# Altium schematic sheet Low Side Drivers.SchDoc: Ravage - Low Side Drivers
size A4; Address1: Drawn By:; Address2: Dan Visser; DocumentNumber: A; Revision: 0.1-alpha; SheetNumber: 12; SheetTotal: 16
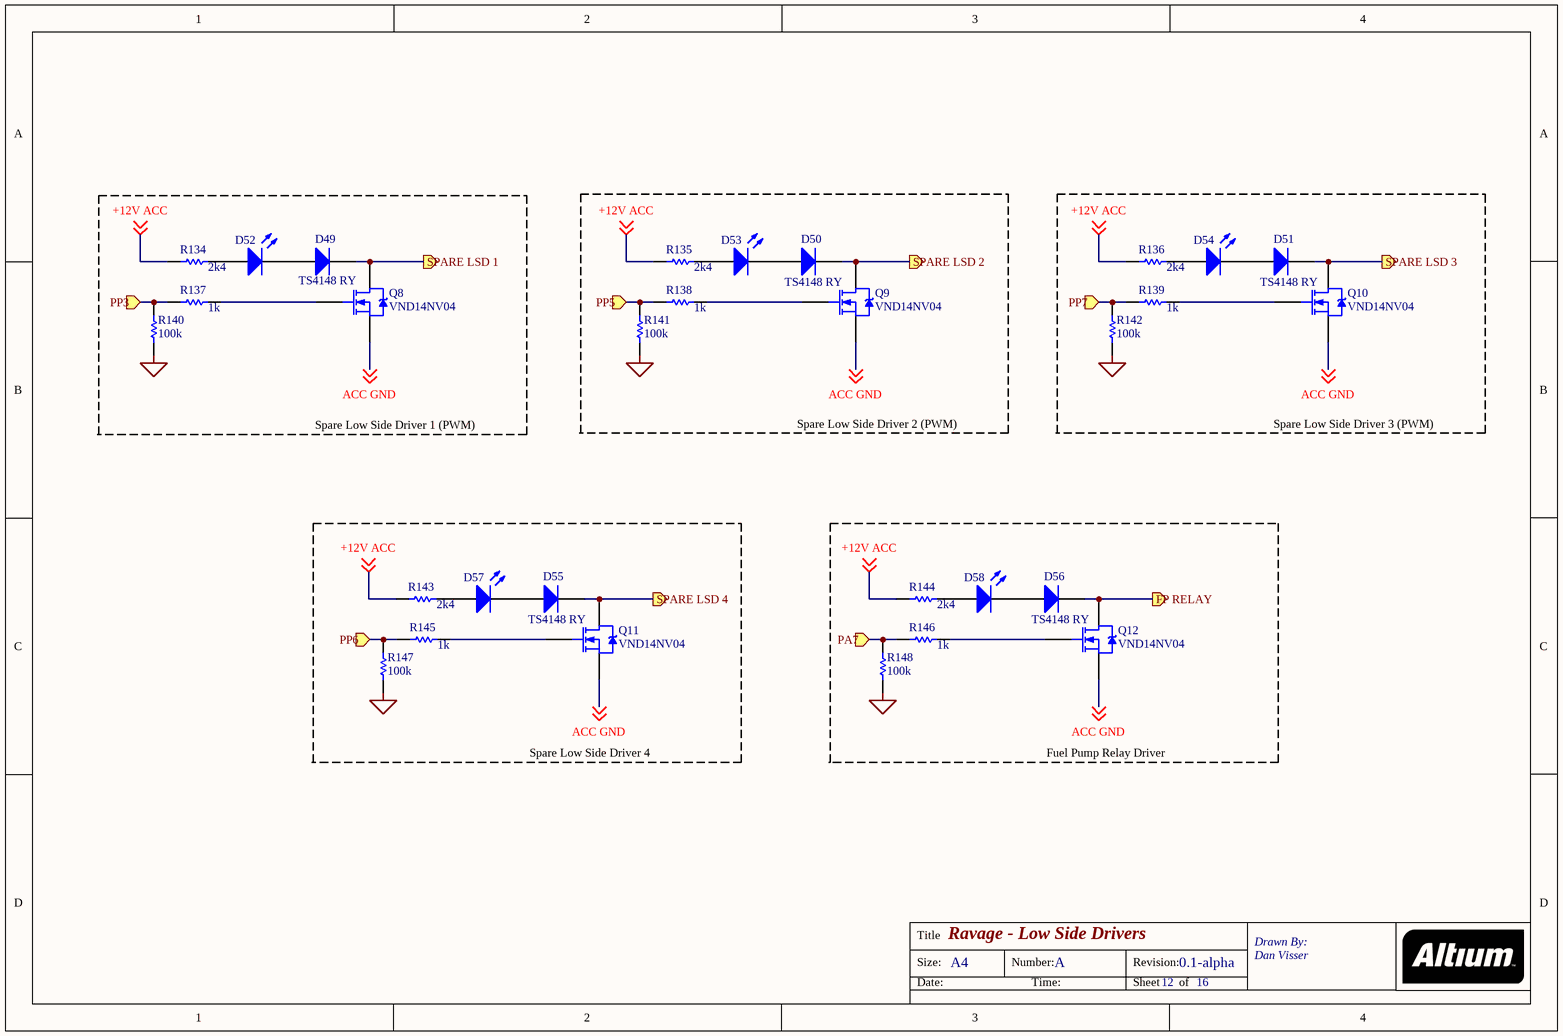
[diagram p0: Low Side Drivers.SchDoc]

## Parts
D49  TS4148 RY  [SMC]
D50  TS4148 RY  [SMC]
D51  TS4148 RY  [SMC]
D52  (no value)  [LED-0]
D53  (no value)  [LED-0]
D54  (no value)  [LED-0]
D55  TS4148 RY  [SMC]
D56  TS4148 RY  [SMC]
D57  (no value)  [LED-0]
D58  (no value)  [LED-0]
Q8  VND14NV04  [TO-220AB]
Q9  VND14NV04  [TO-220AB]
Q10  VND14NV04  [TO-220AB]
Q11  VND14NV04  [TO-220AB]
Q12  VND14NV04  [TO-220AB]
R134  value 2k4  [AXIAL-0.3]
R135  value 2k4  [AXIAL-0.3]
R136  value 2k4  [AXIAL-0.3]
R137  value 1k  [AXIAL-0.3]
R138  value 1k  [AXIAL-0.3]
R139  value 1k  [AXIAL-0.3]
R140  value 100k  [AXIAL-0.3]
R141  value 100k  [AXIAL-0.3]
R142  value 100k  [AXIAL-0.3]
R143  value 2k4  [AXIAL-0.3]
R144  value 2k4  [AXIAL-0.3]
R145  value 1k  [AXIAL-0.3]
R146  value 1k  [AXIAL-0.3]
R147  value 100k  [AXIAL-0.3]
R148  value 100k  [AXIAL-0.3]

## Blocks framed on the sheet
Spare Low Side Driver 2 (PWM): D50 D53 Q9 R135 R138 R141
Spare Low Side Driver 3 (PWM): D51 D54 Q10 R136 R139 R142
Spare Low Side Driver 1 (PWM): D49 D52 Q8 R134 R137 R140
Spare Low Side Driver 4: D55 D57 Q11 R143 R145 R147
Fuel Pump Relay Driver: D56 D58 Q12 R144 R146 R148

## Ports
FP RELAY (out), PA7 (in), PP3 (in), PP5 (in), PP6 (in), PP7 (in), SPARE LSD 1 (out), SPARE LSD 2 (out), SPARE LSD 3 (out), SPARE LSD 4 (out)

## Nets
NetR140_1: R140.1 R141.1 R142.1 R147.1 R148.1
+12V ACC: R134.1 R135.1 R136.1 R143.1 R144.1 ; off-sheet +12V ACC
ACC GND: Q8.3(S) Q9.3(S) Q10.3(S) Q11.3(S) Q12.3(S) ; off-sheet ACC GND
FP RELAY: D56.2(K) Q12.2(D) ; port FP RELAY
PA7: R146.1 R148.2 ; port PA7
PP3: R137.1 R140.2 ; port PP3
PP5: R138.1 R141.2 ; port PP5
PP6: R145.1 R147.2 ; port PP6
PP7: R139.1 R142.2 ; port PP7
SPARE LSD 1: D49.2(K) Q8.2(D) ; port SPARE LSD 1
SPARE LSD 2: D50.2(K) Q9.2(D) ; port SPARE LSD 2
SPARE LSD 3: D51.2(K) Q10.2(D) ; port SPARE LSD 3
SPARE LSD 4: D55.2(K) Q11.2(D) ; port SPARE LSD 4
NetD49_1: D49.1(A) D52.2(K)
NetD50_1: D50.1(A) D53.2(K)
NetD51_1: D51.1(A) D54.2(K)
NetD52_1: D52.1(A) R134.2
NetD53_1: D53.1(A) R135.2
NetD54_1: D54.1(A) R136.2
NetD55_1: D55.1(A) D57.2(K)
NetD56_1: D56.1(A) D58.2(K)
NetD57_1: D57.1(A) R143.2
NetD58_1: D58.1(A) R144.2
NetQ8_1: Q8.1(G) R137.2
NetQ9_1: Q9.1(G) R138.2
NetQ10_1: Q10.1(G) R139.2
NetQ11_1: Q11.1(G) R145.2
NetQ12_1: Q12.1(G) R146.2

## Notes on the sheet
- Title
- Size:
- Date:
- A4
- Number:
- Time:
- Revision:
- Sheet
- of

## Library data of the parts
D49-D51 D55 D56 = Diode: Default Diode; Published: 8-Jun-2000; LatestRevisionDate: 17-Jul-2002; LatestRevisionNote: Re-released for DXP Platform.; PackageVersion: Sep-1996; PackageReference: SMC; Publisher: Altium Limited; PackageDescription: DO-214-AB/SMC; 2 C-Bend Leads; Body 7.9 x 5.9 mm, inc. leads (LxW); Code_JEDEC: DO-214-AB
D52-D54 D57 D58 = LED0: Typical INFRARED GaAs LED; Published: 8-Jun-2000; LatestRevisionDate: 08-Jul-2005; LatestRevisionNote: Mech Layer 1 removed.; PackageReference: LED-0; Publisher: Altium Limited; PackageDescription: LED; 2 Leads
Q8-Q12 = IRL520N: HEXFET Power MOSFET; Note: Pin 2 is electrically connected to pin 4 (Drain).; Published: 8-Jun-2000; LatestRevisionDate: 17-Jul-2002; LatestRevisionNote: Re-released for DXP Platform.; DatasheetVersion: May-1998; PackageVersion: Feb-1997; PackageReference: TO-220AB; Publisher: Altium Limited; PackageDescription: TO, Thru-Hole, Vertical, Heatsink Mounted; 3 In-Line Leads; Pitch 2.54 mm; ComponentLink1Description: Manufacturer Link; ComponentLink1URL: http://www.irf.com/; ComponentLink2Description: Datasheet; ComponentLink2URL: http://www.irf.com/product-info/datasheets/data/irl520n.pdf
R134-R148 = Res1: Resistor; Published: 8-Jun-2000; LatestRevisionDate: 17-Jul-2002; LatestRevisionNote: Re-released for DXP Platform.; PackageReference: AXIAL-0.3; Publisher: Altium Limited; PackageDescription: Axial Device, Thru-Hole; 2 Leads; 0.3 in Pin Spacing